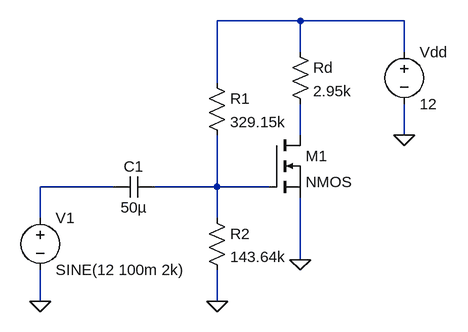
[diagram p0: schematic CircuitDiagram.asc]
CircuitDiagram.asc, the LTspice schematic file:
Version 4
SHEET 1 880 680
WIRE 400 48 272 48
WIRE 560 48 400 48
WIRE 400 96 400 48
WIRE 560 96 560 48
WIRE 272 144 272 48
WIRE 400 224 400 176
WIRE 560 224 560 176
WIRE 112 304 0 304
WIRE 272 304 272 224
WIRE 272 304 176 304
WIRE 352 304 272 304
WIRE 0 352 0 304
WIRE 272 352 272 304
WIRE 400 416 400 320
WIRE 0 480 0 432
WIRE 272 480 272 432
FLAG 400 416 0
FLAG 560 224 0
FLAG 272 480 0
FLAG 0 480 0
SYMBOL nmos 352 224 R0
SYMATTR InstName M1
SYMBOL cap 176 288 R90
WINDOW 0 0 32 VBottom 2
WINDOW 3 32 32 VTop 2
SYMATTR InstName C1
SYMATTR Value 50µ
SYMBOL res 256 128 R0
SYMATTR InstName R1
SYMATTR Value 329.15k
SYMBOL res 256 336 R0
SYMATTR InstName R2
SYMATTR Value 143.64k
SYMBOL res 384 80 R0
SYMATTR InstName Rd
SYMATTR Value 2.95k
SYMBOL voltage 0 336 R0
SYMATTR InstName V1
SYMATTR Value SINE(12 100m 2k)
SYMBOL voltage 560 80 R0
SYMATTR InstName Vdd
SYMATTR Value 12

The netlist it stands for:
* CircuitDiagram.asc
M1 N002 N004 0 0 NMOS
C1 N004 N003 50µ
R1 N001 N004 329.15k
R2 N004 0 143.64k
Rd N001 N002 2.95k
V1 N003 0 SINE(12 100m 2k)
Vdd N001 0 12
.model NMOS NMOS
.model PMOS PMOS
.lib standard.mos
.backanno
.end